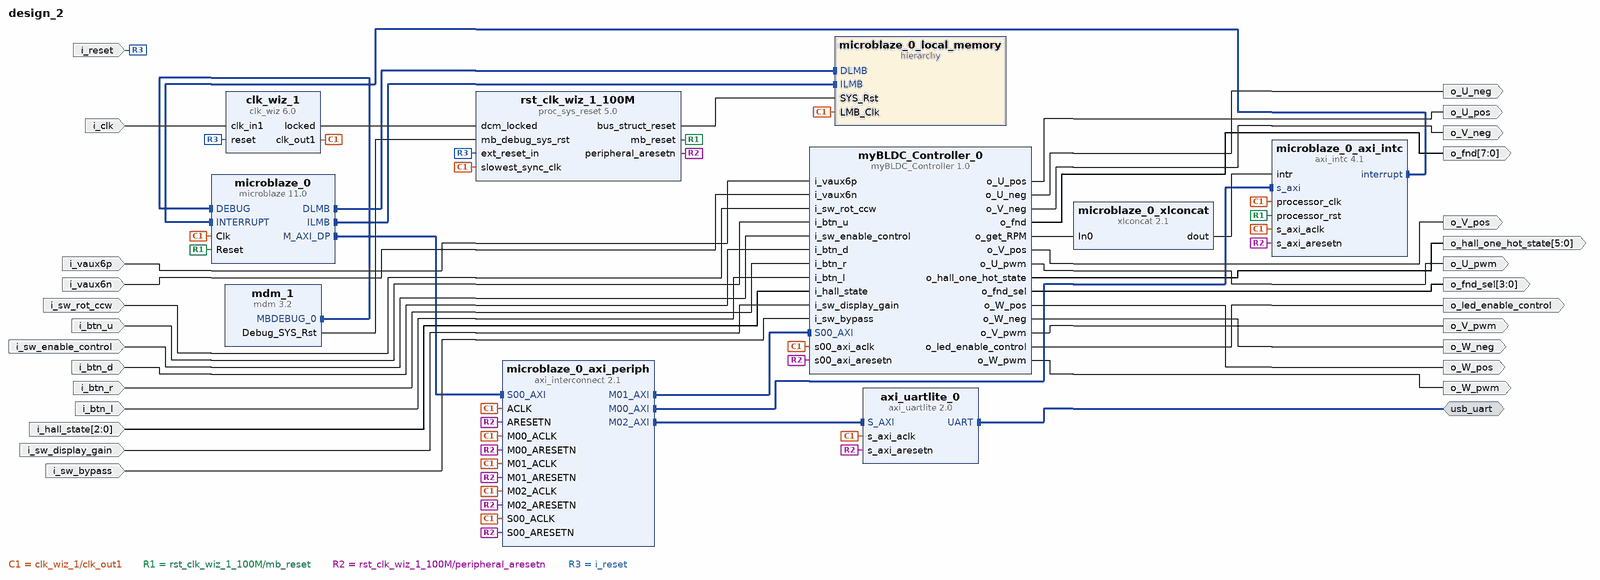
[diagram p0: block diagram of the top level]
# Vivado block design design_2, xc7a35tcpg236-1, Vivado 2019.2
create_bd_design design_2

create_bd_intf_port -mode Master -vlnv xilinx.com:interface:uart_rtl:1.0 usb_uart
create_bd_port -dir I -type clk i_clk
set_property -dict {CONFIG.FREQ_HZ 100000000 CONFIG.PHASE 0.000} [get_bd_ports i_clk]
create_bd_port -dir I -type rst i_reset
set_property -dict {CONFIG.POLARITY ACTIVE_HIGH} [get_bd_ports i_reset]
create_bd_port -dir I -type data i_btn_d
create_bd_port -dir I -type data i_btn_l
create_bd_port -dir I -type data i_btn_r
create_bd_port -dir I -type data i_btn_u
create_bd_port -dir I -from 2 -to 0 -type data i_hall_state
create_bd_port -dir I -type data i_sw_enable_control
create_bd_port -dir I -type data i_sw_rot_ccw
create_bd_port -dir I -type data i_vaux6n
create_bd_port -dir I -type data i_vaux6p
create_bd_port -dir O -type data o_U_neg
create_bd_port -dir O -type data o_U_pos
create_bd_port -dir O -type data o_U_pwm
create_bd_port -dir O -type data o_V_neg
create_bd_port -dir O -type data o_V_pos
create_bd_port -dir O -type data o_V_pwm
create_bd_port -dir O -type data o_W_neg
create_bd_port -dir O -type data o_W_pos
create_bd_port -dir O -type data o_W_pwm
create_bd_port -dir O -from 7 -to 0 -type data o_fnd
create_bd_port -dir O -from 3 -to 0 -type data o_fnd_sel
create_bd_port -dir O -from 5 -to 0 -type data o_hall_one_hot_state
create_bd_port -dir I -type data i_sw_display_gain
create_bd_port -dir O -type data o_led_enable_control
create_bd_port -dir I -type data i_sw_bypass

create_bd_cell -type ip -vlnv xilinx.com:ip:microblaze:11.0 microblaze_0
set_property -dict [list \
  CONFIG.C_DEBUG_ENABLED 1 \
  CONFIG.C_D_AXI 1 \
  CONFIG.C_D_LMB 1 \
  CONFIG.C_I_LMB 1 \
  CONFIG.G_USE_EXCEPTIONS 1 \
] [get_bd_cells microblaze_0]
create_bd_cell -type hier microblaze_0_local_memory
create_bd_cell -type ip -vlnv xilinx.com:ip:axi_interconnect:2.1 microblaze_0_axi_periph
set_property -dict {CONFIG.NUM_MI 3} [get_bd_cells microblaze_0_axi_periph]
create_bd_cell -type ip -vlnv xilinx.com:ip:axi_intc:4.1 microblaze_0_axi_intc
set_property -dict {CONFIG.C_HAS_FAST 1 CONFIG.C_IRQ_IS_LEVEL 0} [get_bd_cells microblaze_0_axi_intc]
create_bd_cell -type ip -vlnv xilinx.com:ip:xlconcat:2.1 microblaze_0_xlconcat
set_property -dict {CONFIG.NUM_PORTS 1} [get_bd_cells microblaze_0_xlconcat]
create_bd_cell -type ip -vlnv xilinx.com:ip:mdm:3.2 mdm_1
create_bd_cell -type ip -vlnv xilinx.com:ip:clk_wiz:6.0 clk_wiz_1
set_property -dict [list \
  CONFIG.CLK_IN1_BOARD_INTERFACE sys_clock \
  CONFIG.PRIM_SOURCE Single_ended_clock_capable_pin \
  CONFIG.RESET_BOARD_INTERFACE reset \
  CONFIG.USE_BOARD_FLOW true \
] [get_bd_cells clk_wiz_1]
create_bd_cell -type ip -vlnv xilinx.com:ip:proc_sys_reset:5.0 rst_clk_wiz_1_100M
set_property -dict {CONFIG.RESET_BOARD_INTERFACE reset CONFIG.USE_BOARD_FLOW true} [get_bd_cells rst_clk_wiz_1_100M]
create_bd_cell -type ip -vlnv xilinx.com:ip:axi_uartlite:2.0 axi_uartlite_0
set_property -dict {CONFIG.UARTLITE_BOARD_INTERFACE usb_uart CONFIG.USE_BOARD_FLOW true} [get_bd_cells axi_uartlite_0]
create_bd_cell -type ip -vlnv xilinx.com:user:myBLDC_Controller:1.0 myBLDC_Controller_0

# ---- hierarchy /microblaze_0_local_memory ----
current_bd_instance /microblaze_0_local_memory
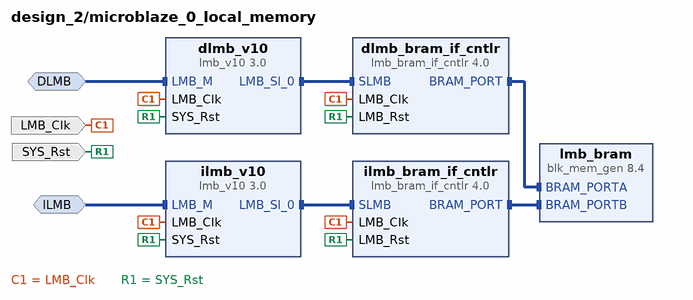
[diagram p1: block diagram inside /microblaze_0_local_memory]
create_bd_intf_pin -mode MirroredMaster -vlnv xilinx.com:interface:lmb_rtl:1.0 DLMB
create_bd_intf_pin -mode MirroredMaster -vlnv xilinx.com:interface:lmb_rtl:1.0 ILMB
create_bd_pin -dir I -type clk LMB_Clk
create_bd_pin -dir I -type rst SYS_Rst

create_bd_cell -type ip -vlnv xilinx.com:ip:lmb_v10:3.0 dlmb_v10
create_bd_cell -type ip -vlnv xilinx.com:ip:lmb_v10:3.0 ilmb_v10
create_bd_cell -type ip -vlnv xilinx.com:ip:lmb_bram_if_cntlr:4.0 dlmb_bram_if_cntlr
set_property -dict {CONFIG.C_ECC 0} [get_bd_cells dlmb_bram_if_cntlr]
create_bd_cell -type ip -vlnv xilinx.com:ip:lmb_bram_if_cntlr:4.0 ilmb_bram_if_cntlr
set_property -dict {CONFIG.C_ECC 0} [get_bd_cells ilmb_bram_if_cntlr]
create_bd_cell -type ip -vlnv xilinx.com:ip:blk_mem_gen:8.4 lmb_bram
set_property -dict {CONFIG.Memory_Type True_Dual_Port_RAM CONFIG.use_bram_block BRAM_Controller} [get_bd_cells lmb_bram]

# ---- connections ----

current_bd_instance /microblaze_0_local_memory
connect_bd_intf_net -intf_net microblaze_0_ilmb_bus [get_bd_intf_pins ilmb_v10/LMB_Sl_0] [get_bd_intf_pins ilmb_bram_if_cntlr/SLMB]
connect_bd_intf_net -intf_net microblaze_0_dlmb [get_bd_intf_pins DLMB] [get_bd_intf_pins dlmb_v10/LMB_M]
connect_bd_intf_net -intf_net microblaze_0_dlmb_bus [get_bd_intf_pins dlmb_v10/LMB_Sl_0] [get_bd_intf_pins dlmb_bram_if_cntlr/SLMB]
connect_bd_intf_net -intf_net microblaze_0_ilmb_cntlr [get_bd_intf_pins ilmb_bram_if_cntlr/BRAM_PORT] [get_bd_intf_pins lmb_bram/BRAM_PORTB]
connect_bd_intf_net -intf_net microblaze_0_dlmb_cntlr [get_bd_intf_pins dlmb_bram_if_cntlr/BRAM_PORT] [get_bd_intf_pins lmb_bram/BRAM_PORTA]
connect_bd_intf_net -intf_net microblaze_0_ilmb [get_bd_intf_pins ILMB] [get_bd_intf_pins ilmb_v10/LMB_M]
connect_bd_net -net microblaze_0_Clk [get_bd_pins LMB_Clk] \
  [get_bd_pins dlmb_v10/LMB_Clk] [get_bd_pins dlmb_bram_if_cntlr/LMB_Clk] [get_bd_pins ilmb_v10/LMB_Clk] \
  [get_bd_pins ilmb_bram_if_cntlr/LMB_Clk]
connect_bd_net [get_bd_pins SYS_Rst] \
  [get_bd_pins dlmb_v10/SYS_Rst] [get_bd_pins dlmb_bram_if_cntlr/LMB_Rst] [get_bd_pins ilmb_v10/SYS_Rst] \
  [get_bd_pins ilmb_bram_if_cntlr/LMB_Rst]
set_property HDL_ATTRIBUTE.BMM_INFO_ADDRESS_SPACE {byte  0x00000000 32 > design_2 microblaze_0_local_memory/lmb_bram} [get_bd_cells dlmb_bram_if_cntlr]
set_property HDL_ATTRIBUTE.KEEP_HIERARCHY yes [get_bd_cells dlmb_bram_if_cntlr]

current_bd_instance /
connect_bd_intf_net -intf_net microblaze_0_intc_axi [get_bd_intf_pins microblaze_0_axi_periph/M00_AXI] [get_bd_intf_pins microblaze_0_axi_intc/s_axi]
connect_bd_intf_net -intf_net microblaze_0_axi_dp [get_bd_intf_pins microblaze_0_axi_periph/S00_AXI] [get_bd_intf_pins microblaze_0/M_AXI_DP]
connect_bd_intf_net [get_bd_intf_pins mdm_1/MBDEBUG_0] [get_bd_intf_pins microblaze_0/DEBUG]
connect_bd_intf_net [get_bd_intf_pins microblaze_0_axi_intc/interrupt] [get_bd_intf_pins microblaze_0/INTERRUPT]
connect_bd_intf_net [get_bd_intf_pins microblaze_0/DLMB] [get_bd_intf_pins microblaze_0_local_memory/DLMB]
connect_bd_intf_net [get_bd_intf_pins microblaze_0/ILMB] [get_bd_intf_pins microblaze_0_local_memory/ILMB]
connect_bd_intf_net [get_bd_intf_pins microblaze_0_axi_periph/M01_AXI] [get_bd_intf_pins myBLDC_Controller_0/S00_AXI]
connect_bd_intf_net [get_bd_intf_pins microblaze_0_axi_periph/M02_AXI] [get_bd_intf_pins axi_uartlite_0/S_AXI]
connect_bd_intf_net [get_bd_intf_ports usb_uart] [get_bd_intf_pins axi_uartlite_0/UART]
connect_bd_net -net microblaze_0_intr [get_bd_pins microblaze_0_xlconcat/dout] [get_bd_pins microblaze_0_axi_intc/intr]
connect_bd_net -net microblaze_0_Clk [get_bd_pins clk_wiz_1/clk_out1] \
  [get_bd_pins microblaze_0/Clk] [get_bd_pins microblaze_0_axi_periph/ACLK] [get_bd_pins microblaze_0_axi_periph/S00_ACLK] \
  [get_bd_pins microblaze_0_axi_periph/M00_ACLK] [get_bd_pins microblaze_0_axi_intc/s_axi_aclk] \
  [get_bd_pins microblaze_0_axi_intc/processor_clk] [get_bd_pins microblaze_0_local_memory/LMB_Clk] \
  [get_bd_pins rst_clk_wiz_1_100M/slowest_sync_clk] [get_bd_pins microblaze_0_axi_periph/M01_ACLK] \
  [get_bd_pins axi_uartlite_0/s_axi_aclk] [get_bd_pins microblaze_0_axi_periph/M02_ACLK] \
  [get_bd_pins myBLDC_Controller_0/s00_axi_aclk]
connect_bd_net [get_bd_pins clk_wiz_1/locked] [get_bd_pins rst_clk_wiz_1_100M/dcm_locked]
connect_bd_net [get_bd_pins rst_clk_wiz_1_100M/mb_reset] [get_bd_pins microblaze_0/Reset] [get_bd_pins microblaze_0_axi_intc/processor_rst]
connect_bd_net [get_bd_pins rst_clk_wiz_1_100M/bus_struct_reset] [get_bd_pins microblaze_0_local_memory/SYS_Rst]
connect_bd_net [get_bd_pins rst_clk_wiz_1_100M/peripheral_aresetn] \
  [get_bd_pins microblaze_0_axi_periph/ARESETN] [get_bd_pins microblaze_0_axi_periph/S00_ARESETN] \
  [get_bd_pins microblaze_0_axi_periph/M00_ARESETN] [get_bd_pins microblaze_0_axi_intc/s_axi_aresetn] \
  [get_bd_pins microblaze_0_axi_periph/M01_ARESETN] [get_bd_pins axi_uartlite_0/s_axi_aresetn] \
  [get_bd_pins microblaze_0_axi_periph/M02_ARESETN] [get_bd_pins myBLDC_Controller_0/s00_axi_aresetn]
connect_bd_net [get_bd_pins mdm_1/Debug_SYS_Rst] [get_bd_pins rst_clk_wiz_1_100M/mb_debug_sys_rst]
connect_bd_net -net sys_clock_1 [get_bd_ports i_clk] [get_bd_pins clk_wiz_1/clk_in1]
connect_bd_net -net reset_1 [get_bd_ports i_reset] [get_bd_pins clk_wiz_1/reset] [get_bd_pins rst_clk_wiz_1_100M/ext_reset_in]
connect_bd_net [get_bd_ports i_vaux6p] [get_bd_pins myBLDC_Controller_0/i_vaux6p]
connect_bd_net [get_bd_ports i_vaux6n] [get_bd_pins myBLDC_Controller_0/i_vaux6n]
connect_bd_net [get_bd_ports i_sw_rot_ccw] [get_bd_pins myBLDC_Controller_0/i_sw_rot_ccw]
connect_bd_net [get_bd_ports i_btn_u] [get_bd_pins myBLDC_Controller_0/i_btn_u]
connect_bd_net [get_bd_ports i_sw_enable_control] [get_bd_pins myBLDC_Controller_0/i_sw_enable_control]
connect_bd_net [get_bd_ports i_btn_d] [get_bd_pins myBLDC_Controller_0/i_btn_d]
connect_bd_net [get_bd_ports i_btn_r] [get_bd_pins myBLDC_Controller_0/i_btn_r]
connect_bd_net [get_bd_ports i_btn_l] [get_bd_pins myBLDC_Controller_0/i_btn_l]
connect_bd_net [get_bd_ports i_hall_state] [get_bd_pins myBLDC_Controller_0/i_hall_state]
connect_bd_net [get_bd_pins myBLDC_Controller_0/o_get_RPM] [get_bd_pins microblaze_0_xlconcat/In0]
connect_bd_net [get_bd_pins myBLDC_Controller_0/o_U_pos] [get_bd_ports o_U_pos]
connect_bd_net [get_bd_pins myBLDC_Controller_0/o_U_neg] [get_bd_ports o_U_neg]
connect_bd_net [get_bd_pins myBLDC_Controller_0/o_V_pos] [get_bd_ports o_V_pos]
connect_bd_net [get_bd_pins myBLDC_Controller_0/o_V_neg] [get_bd_ports o_V_neg]
connect_bd_net [get_bd_pins myBLDC_Controller_0/o_W_pos] [get_bd_ports o_W_pos]
connect_bd_net [get_bd_pins myBLDC_Controller_0/o_W_neg] [get_bd_ports o_W_neg]
connect_bd_net [get_bd_pins myBLDC_Controller_0/o_U_pwm] [get_bd_ports o_U_pwm]
connect_bd_net [get_bd_pins myBLDC_Controller_0/o_V_pwm] [get_bd_ports o_V_pwm]
connect_bd_net [get_bd_pins myBLDC_Controller_0/o_W_pwm] [get_bd_ports o_W_pwm]
connect_bd_net [get_bd_pins myBLDC_Controller_0/o_hall_one_hot_state] [get_bd_ports o_hall_one_hot_state]
connect_bd_net [get_bd_pins myBLDC_Controller_0/o_fnd] [get_bd_ports o_fnd]
connect_bd_net [get_bd_pins myBLDC_Controller_0/o_fnd_sel] [get_bd_ports o_fnd_sel]
connect_bd_net -net i_display_gain_1 [get_bd_ports i_sw_display_gain] [get_bd_pins myBLDC_Controller_0/i_sw_display_gain]
connect_bd_net [get_bd_pins myBLDC_Controller_0/o_led_enable_control] [get_bd_ports o_led_enable_control]
connect_bd_net [get_bd_ports i_sw_bypass] [get_bd_pins myBLDC_Controller_0/i_sw_bypass]
set_property HDL_ATTRIBUTE.BMM_INFO_PROCESSOR {microblaze-le > design_2 microblaze_0_local_memory/dlmb_bram_if_cntlr} [get_bd_cells microblaze_0]
set_property HDL_ATTRIBUTE.KEEP_HIERARCHY yes [get_bd_cells microblaze_0]

# ---- address map ----
assign_bd_address -offset 0x00000000 -range 128K -target_address_space [get_bd_addr_spaces microblaze_0/Data] [get_bd_addr_segs microblaze_0_local_memory/dlmb_bram_if_cntlr/SLMB/Mem]
assign_bd_address -offset 0x40600000 -range 64K -target_address_space [get_bd_addr_spaces microblaze_0/Data] [get_bd_addr_segs axi_uartlite_0/S_AXI/Reg]
assign_bd_address -offset 0x41200000 -range 64K -target_address_space [get_bd_addr_spaces microblaze_0/Data] [get_bd_addr_segs microblaze_0_axi_intc/S_AXI/Reg]
assign_bd_address -offset 0x44A00000 -range 64K -target_address_space [get_bd_addr_spaces microblaze_0/Data] [get_bd_addr_segs myBLDC_Controller_0/S00_AXI/S00_AXI_reg]
assign_bd_address -offset 0x00000000 -range 128K -target_address_space [get_bd_addr_spaces microblaze_0/Instruction] [get_bd_addr_segs microblaze_0_local_memory/ilmb_bram_if_cntlr/SLMB/Mem]

validate_bd_design
save_bd_design
